# Altium schematic sheet switch.SchDoc
size A2
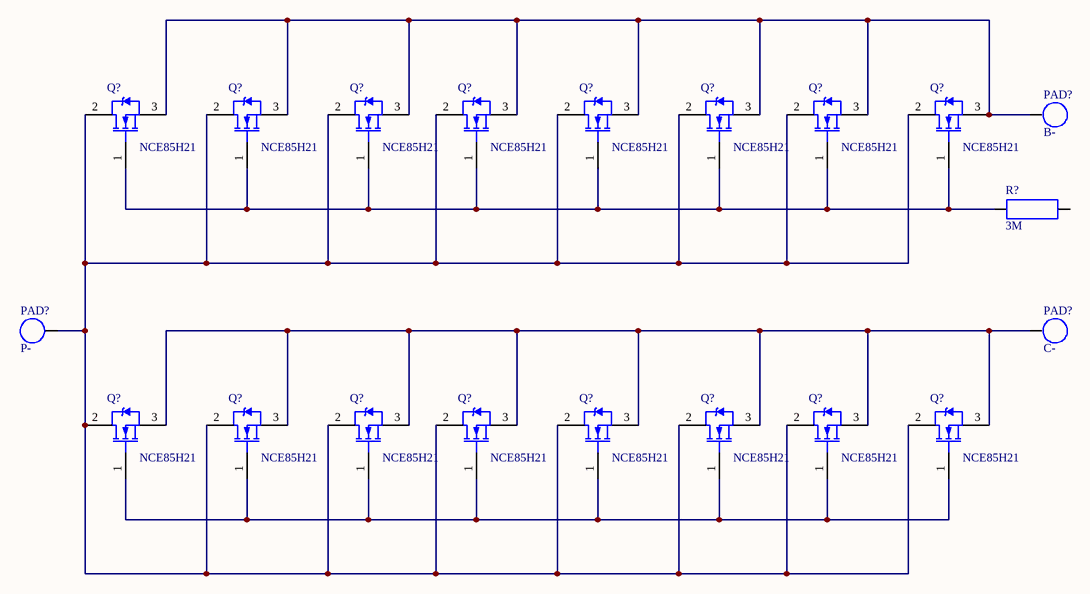
[diagram p0: switch.SchDoc]

## Parts
(Parts that share a designator on the sheet are numbered #1, #2 ... from top to bottom, then left to right.)
PAD?#1  B-  [PAD]
PAD?#2  P-  [PAD]
PAD?#3  C-  [PAD]
Q?#1  NCE85H21  [NCE85H21]
Q?#2  NCE85H21  [NCE85H21]
Q?#3  NCE85H21  [NCE85H21]
Q?#4  NCE85H21  [NCE85H21]
Q?#5  NCE85H21  [NCE85H21]
Q?#6  NCE85H21  [NCE85H21]
Q?#7  NCE85H21  [NCE85H21]
Q?#8  NCE85H21  [NCE85H21]
Q?#9  NCE85H21  [NCE85H21]
Q?#10  NCE85H21  [NCE85H21]
Q?#11  NCE85H21  [NCE85H21]
Q?#12  NCE85H21  [NCE85H21]
Q?#13  NCE85H21  [NCE85H21]
Q?#14  NCE85H21  [NCE85H21]
Q?#15  NCE85H21  [NCE85H21]
Q?#16  NCE85H21  [NCE85H21]
R?  3M  [R0805]

## Nets
NetPAD?#1_1: PAD?#1.1 Q?#1.3(S) Q?#2.3(S) Q?#3.3(S) Q?#4.3(S) Q?#5.3(S) Q?#6.3(S) Q?#7.3(S) Q?#8.3(S)
NetPAD?#2_1: PAD?#2.1 Q?#1.2(D) Q?#2.2(D) Q?#3.2(D) Q?#4.2(D) Q?#5.2(D) Q?#6.2(D) Q?#7.2(D) Q?#8.2(D) Q?#9.2(D) Q?#10.2(D) Q?#11.2(D) Q?#12.2(D) Q?#13.2(D) Q?#14.2(D) Q?#15.2(D) Q?#16.2(D)
NetPAD?#3_1: PAD?#3.1 Q?#9.3(S) Q?#10.3(S) Q?#11.3(S) Q?#12.3(S) Q?#13.3(S) Q?#14.3(S) Q?#15.3(S) Q?#16.3(S)
NetQ?#1_1: Q?#1.1(G) Q?#2.1(G) Q?#3.1(G) Q?#4.1(G) Q?#5.1(G) Q?#6.1(G) Q?#7.1(G) Q?#8.1(G) R?.1
NetQ?#9_1: Q?#9.1(G) Q?#10.1(G) Q?#11.1(G) Q?#12.1(G) Q?#13.1(G) Q?#14.1(G) Q?#15.1(G) Q?#16.1(G)

Not connected (* = marked no-connect by the designer): R? 2

## Library data of the parts
PAD?#1-PAD?#3 = PAD
R? = Resistor